# Altium schematic sheet Custom ST-Link V2.1.SchDoc: Custom ST-Link V2.1
size A3; PageSetup: Record=PageOptions|CenterHorizontal=True|CenterVertical=True|PrintScale=0.97|XCorrection=1.00|YCorrection=1.00|PrintKind=0|BorderSize=5000000|LeftOffset=0|BottomOffset=0|Orientation=2|PaperLength=1000|PaperWidth=1000|Scale=100|PaperSource=7|PrintQuality=-3|MediaType=1|DitherType=10|PrintScaleMode=1|PaperKind=A4|PaperIndex=9; Address2: Florian Baumgartner; DocumentNumber: Based on ST-Link V2.x design; Revision: V1.0; SheetNumber: 1; SheetTotal: 2; Author: Florian Baumgartner
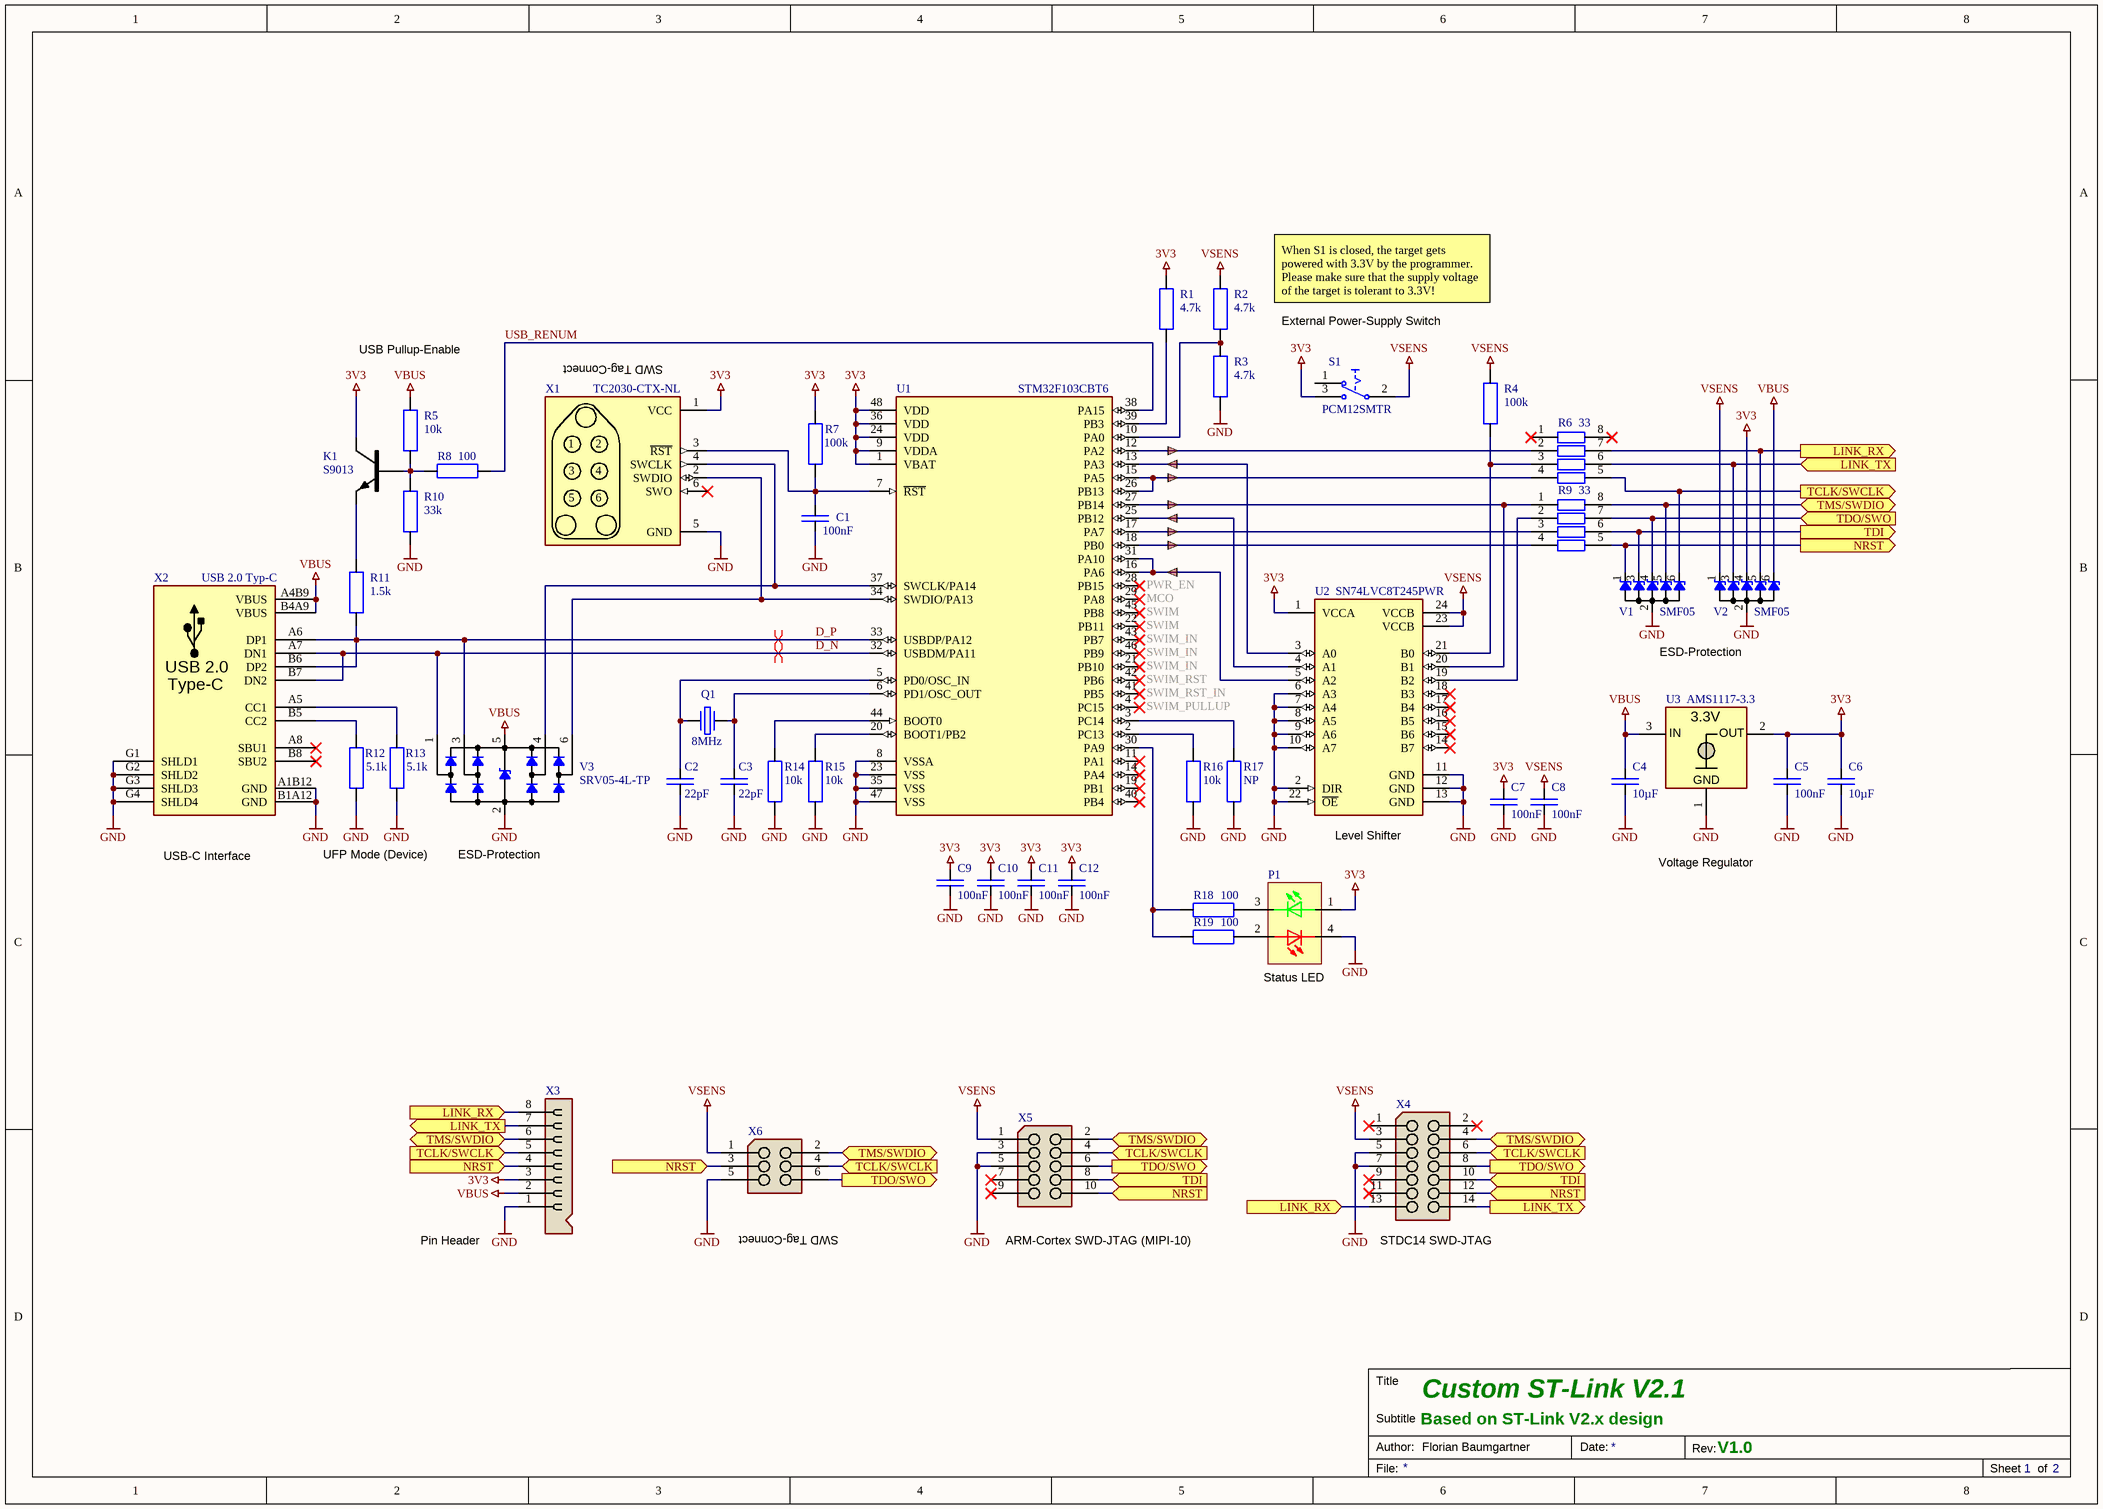
[diagram p0: Custom ST-Link V2.1.SchDoc]

## Parts
C1  100nF  [SMD Keramikkondensator 0402]
C2  22pF  [SMD Keramikkondensator 0402]
C3  22pF  [SMD Keramikkondensator 0402]
C4  10µF  [SMD Keramikkondensator 0603]
C5  100nF  [SMD Keramikkondensator 0402]
C6  10µF  [SMD Keramikkondensator 0603]
C7  100nF  [SMD Keramikkondensator 0402]
C8  100nF  [SMD Keramikkondensator 0402]
C9  100nF  [SMD Keramikkondensator 0402]
C10  100nF  [SMD Keramikkondensator 0402]
C11  100nF  [SMD Keramikkondensator 0402]
C12  100nF  [SMD Keramikkondensator 0402]
K1  S9013  [SMD Transistor SOT-23]
P1  LTST-C155KGJRKT  [SMD LED 1210]  (value not drawn)
Q1  8MHz  [SMD Crystal 5.0X3.2X1.8]
R1  4.7k  [SMD Widerstand 0402]
R2  4.7k  [SMD Widerstand 0402]
R3  4.7k  [SMD Widerstand 0402]
R4  100k  [SMD Widerstand 0402]
R5  10k  [SMD Widerstand 0402]
R6  33  [SMD Widerstand Array 4-Fach 0402]
R7  100k  [SMD Widerstand 0402]
R8  100  [SMD Widerstand 0402]
R9  33  [SMD Widerstand Array 4-Fach 0402]
R10  33k  [SMD Widerstand 0402]
R11  1.5k  [SMD Widerstand 0402]
R12  5.1k  [SMD Widerstand 0402]
R13  5.1k  [SMD Widerstand 0402]
R14  10k  [SMD Widerstand 0402]
R15  10k  [SMD Widerstand 0402]
R16  10k  [SMD Widerstand 0402]
R17  NP  [SMD Widerstand 0402]
R18  100  [SMD Widerstand 0402]
R19  100  [SMD Widerstand 0402]
S1  PCM12SMTR  [SMD Switch SPDT (PCM12SMTR)]
U1  STM32F103CBT6  [SMD IC LQFP-48]
U2  SN74LVC8T245PWR  [SMD IC TSSOP-24]
U3  AMS1117-3.3  [SMD IC SOT-223]
V1  SMF05  [SMD IC SOT-363 (SC-70-6)]
V2  SMF05  [SMD IC SOT-363 (SC-70-6)]
V3  SRV05-4L-TP  [SMD IC SOT-23-6]
X1  TC2030-CTX-NL  [SMD Connector TC2030-CTX-NL]  (no BOM)
X2  USB 2.0 Typ-C  [SMD USB-C Socket (A40-00119)]
X3  Buchsenleiste (8-Fach)  [SMD Buchsenleiste 8-Pol (1x8) 90°]  (value not drawn)
X4  JTAG-Header (STDC14)  [SMD Connector 1.27mm (2x7)]  (value not drawn)
X5  JTAG-Header (ARM-Cortex)  [SMD Connector 1.27mm (2x5)]  (value not drawn)
X6  JTAG-Header (Tag-Connect)  [SMD Flachbandkabel 6-Pol Vertikal]  (value not drawn)

## Ports
LINK_RX (in), LINK_RX (out), LINK_TX (in), LINK_TX (out), NRST (in), NRST (out), TCLK/SWCLK (in), TCLK/SWCLK (out), TDI (in), TDI (out), TDO/SWO (in), TDO/SWO (out), TMS/SWDIO (bidir)

## Nets
3V3: C5.2 C6.2 C7.2 C9.2 C10.2 C11.2 C12.2 K1.C P1.1(GA) R1.2 R7.2 S1.3(NO1) U1.1(VBAT) U1.9(VDDA) U1.24(VDD) U1.36(VDD) U1.48(VDD) U2.1(VCCA) U3.2(OUT) V2.4(K) X1.1(VCC) X3.3
GND: C1.1 C2.2 C3.2 C4.1 C5.1 C6.1 C7.1 C8.1 C9.1 C10.1 C11.1 C12.1 P1.4(RC) R3.1 R10.1 R12.1 R13.1 R14.1 R15.1 R16.1 R17.1 U1.8(VSSA) U1.23(VSS) U1.35(VSS) U1.47(VSS) U2.2(DIR) U2.6(A3) U2.7(A4) U2.8(A5) U2.9(A6) U2.10(A7) U2.11(GND) U2.12(GND) U2.13(GND) U2.22(~{OE}) U3.1(GND) V1.2(A) V2.2(A) V3.2(A) X1.5(GND) X2.A1B12(GND) X2.B1A12(GND) X2.G1(SHLD1) X2.G2(SHLD2) X2.G3(SHLD3) X2.G4(SHLD4) X3.1 X4.5 X4.7 X5.3 X5.5 X6.5
VBUS: C4.2 R5.2 U3.3(IN) V2.6(K) V3.5(K) X2.A4B9(VBUS) X2.B4A9(VBUS) X3.2
VSENS: C8.2 R2.2 R4.2 S1.2(COMMON1) U2.23(VCCB) U2.24(VCCB) V2.1(K) X4.3 X5.1 X6.1
D_N: U1.32(USBDM/PA11) V3.1(K) X2.A7(DN1) X2.B7(DN2)
D_P: R11.1 U1.33(USBDP/PA12) V3.3(K) X2.A6(DP1) X2.B6(DP2)
LINK_RX: R6.7 V2.5(K) X3.8 X4.13 ; port LINK_RX
LINK_TX: R6.6 V2.3(K) X3.7 X4.14 ; port LINK_TX
NRST: R9.5 V1.1(K) X3.4 X4.12 X5.10 X6.3 ; port NRST
TCLK/SWCLK: R6.5 V1.6(K) X3.5 X4.6 X5.4 X6.4 ; port TCLK/SWCLK
TDI: R9.6 V1.3(K) X4.10 X5.8 ; port TDI
TDO/SWO: R9.7 V1.4(K) X4.8 X5.6 X6.6 ; port TDO/SWO
TMS/SWDIO: R9.8 V1.5(K) X3.6 X4.4 X5.2 X6.2 ; port TMS/SWDIO
USB_RENUM: R8.2 U1.38(PA15)
NetC1_2: C1.2 R7.1 U1.7(~{RST}) X1.3(~{RST})
NetC2_1: C2.1 Q1.1 U1.5(PD0/OSC_IN)
NetC3_1: C3.1 Q1.2 U1.6(PD1/OSC_OUT)
NetK1_B: K1.B R5.1 R8.1 R10.2
NetK1_E: K1.E R11.2
NetP1_2: P1.2(RA) R19.2
NetP1_3: P1.3(GC) R18.2
NetR1_1: R1.1 U1.39(PB3)
NetR2_1: R2.1 R3.2 U1.10(PA0)
NetR4_1: R4.1 R6.3 U2.21(B0)
NetR6_2: R6.2 U1.12(PA2)
NetR6_4: R6.4 U1.15(PA5) U1.26(PB13)
NetR9_1: R9.1 U1.27(PB14) U2.20(B1)
NetR9_2: R9.2 U2.19(B2)
NetR9_3: R9.3 U1.17(PA7)
NetR9_4: R9.4 U1.18(PB0)
NetR12_2: R12.2 X2.B5(CC2)
NetR13_2: R13.2 X2.A5(CC1)
NetR14_2: R14.2 U1.44(BOOT0)
NetR15_2: R15.2 U1.20(BOOT1/PB2)
NetR16_2: R16.2 U1.2(PC13)
NetR17_2: R17.2 U1.3(PC14)
NetR18_1: R18.1 R19.1 U1.30(PA9)
NetU1_13: U1.13(PA3) U2.3(A0)
NetU1_16: U1.16(PA6) U1.31(PA10) U2.5(A2)
NetU1_25: U1.25(PB12) U2.4(A1)
NetU1_34: U1.34(SWDIO/PA13) V3.6(K) X1.2(SWDIO)
NetU1_37: U1.37(SWCLK/PA14) V3.4(K) X1.4(SWCLK)

Not connected (* = marked no-connect by the designer): R6 1* 8*; S1 1(NC1); U1 4(PC15)* 11(PA1)* 14(PA4)* 19(PB1)* 21(PB10)* 22(PB11)* 28(PB15)* 29(PA8)* 40(PB4)* 41(PB5)* 42(PB6)* 43(PB7)* 45(PB8)* 46(PB9)*; U2 14(B7)* 15(B6)* 16(B5)* 17(B4)* 18(B3)*; X1 6(SWO)*; X2 A8(SBU1)* B8(SBU2)*; X4 1* 2* 9* 11*; X5 7* 9*

## Layout directives
differential pair: D_N, D_P

## Notes on the sheet
- When S1 is closed, the target gets powered with 3.3V by the programmer.
  Please make sure that the supply voltage of the target is tolerant to 3.3V!
- USB Pullup-Enable
- (near X1) SWD Tag-Connect
- External Power-Supply Switch
- (near U1) PWR_EN
- (near U1) MCO
- (near U1) SWIM
- (near U1) SWIM_IN
- (near U1) SWIM_RST_IN
- (near U1) SWIM_RST
- SWIM_PULLUP
- ESD-Protection
- (near X2) USB-C Interface
- UFP Mode (Device)
- (near V3) ESD-Protection
- (near U2) Level Shifter
- Voltage Regulator
- Status LED
- Pin Header
- SWD Tag-Connect
- (near X5) ARM-Cortex SWD-JTAG (MIPI-10)
- (near X4) STDC14 SWD-JTAG
- Title
- Author:
- Subtitle
- Date:
- Rev:
- File:
- Sheet
- of
- (in symbol T-AMS1117-3.3) 3.3V
- (in symbol X-USB-Buchse) USB 2.0; Type-C

## Library data of the parts
C1 C5 C7-C12 = C-CAPACITOR: CAP-MK; Beschreibung: Keramikvielschichtkondensator; Bauteilwert: 100nF 50V; Stückpreis: 0.01; Digikey: 445-6899-1-ND; Farnell: 2210822; Mouser: 810-CGA2B3X7R1H104K; JLC-Parts: C1525
C2 C3 = C-CAPACITOR: CAP-MK; Beschreibung: Keramikvielschichtkondensator; Stückpreis: 0.01; Bauteilwert: 22pF; Digikey: 311-1018-1-ND; Farnell: 3019184; Mouser: 603-CC402JRNPO9BN220; JLC-Parts: C1555
C4 C6 = C-CAPACITOR: CAP-MK; Beschreibung: Keramikvielschichtkondensator; Bauteilwert: 10µF 10V; Stückpreis: 0.17; Digikey: 587-3258-1-ND; Farnell: 2113070; Mouser: 963-LMK107BBJ106MALT; JLC-Parts: C19702
K1 = K-BIPT:NPN: Transistor NPN (alt V und T); Beschreibung: General Purpose Transistor NPN; aliExpress: 4001032177922; Stückpreis: 0.01; Bauteilwert: S9013; ComponentLink1Description: Datasheet; ComponentLink1URL: https://datasheet.lcsc.com/szlcsc/Changjiang-Electronics-Tech-CJ-S9013_C6749.pdf; JLC-Parts: C6749
P1 = P-LTST-C155KGJRKT: LED Red/Green; Stückpreis: 0.35; Bauteilwert: LTST-C155KGJRKT; Beschreibung: LED Red/Green; Digikey: 160-1409-1-ND; Farnell: 2062277; Mouser: 859-LTST-C155KGJRKT; ComponentLink1Description: Datasheet; ComponentLink1URL: https://datasheet.lcsc.com/szlcsc/Lite-On-LTST-C155KGJRKT_C115448.pdf; JLC-Parts: C115448
Q1 = B-QUARZ: Crystal with Shielding; Bauteilwert: X50328MSB2GI (8MHz); aliExpress: 32890177031; Stückpreis: 0.17; Beschreibung: Crystal with Shielding; JLC-Parts: C115962; ComponentLink1Description: Datasheet; ComponentLink1URL: https://datasheet.lcsc.com/szlcsc/1903061615_Yangxing-Tech-X50328MSB2GI_C115962.pdf
R1-R3 = R-RESISTOR: SMD-Widerstand 1/4W; Beschreibung: Dickschicht Chipwiderstand; Bauteilwert: 4.7k (75V, 100mW, 1%); Stückpreis: 0.01; Digikey: P4.70KLCT-ND; Farnell: 2302707; Mouser: 667-ERJ-2RKF4701X; JLC-Parts: C25900
R4 R7 = R-RESISTOR: RES (E=Heizwiderstand B=Messwandler); Beschreibung: Dickschicht Chipwiderstand; Bauteilwert: 100k (75V, 100mW, 1%); Stückpreis: 0.01; Digikey: P100KLCT-ND; Farnell: 2302839; Mouser: 667-ERJ-2RKF1003X; JLC-Parts: C25741
R5 R14-R16 = R-RESISTOR: RES (E=Heizwiderstand B=Messwandler); Beschreibung: Dickschicht Chipwiderstand; Bauteilwert: 10k (75V, 100mW, 1%); Stückpreis: 0.01; Digikey: P10.0KLCT-ND; Farnell: 2302739; Mouser: 667-ERJ-2RKF1002X; JLC-Parts: C25744
R6 R9 = R-Array Single (4-Fach): Isolated Resistor Array; Bauteilwert: 33 (4x, 50V, 62.5mW, 5%); Stückpreis: 0.01; Beschreibung: Isolated Resistor Array; Digikey: Y7330CT-ND; Farnell: 2060035; JLC-Parts: C25501; Mouser: 667-EXB-28V330JX
R8 R18 R19 = R-RESISTOR: SMD-Widerstand 1/4W; Beschreibung: Dickschicht Chipwiderstand; Bauteilwert: 100 (75V, 100mW, 1%); Stückpreis: 0.06; Digikey: P100LCT-ND; Farnell: 2302528; Mouser: 667-ERJ-2RKF1000X; JLC-Parts: C25076
R10 = R-RESISTOR: RES (E=Heizwiderstand B=Messwandler); Beschreibung: Dickschicht Chipwiderstand; Bauteilwert: 33k (75V, 100mW, 1%); Stückpreis: 0.01; Digikey: P33.0KLCT-ND; Farnell: 2561707; Mouser: 667-ERJ-2RKF3302X; JLC-Parts: C25779
R11 = R-RESISTOR: RES (E=Heizwiderstand B=Messwandler); Beschreibung: Dickschicht Chipwiderstand; Bauteilwert: 1.5k (75V, 100mW, 1%); Stückpreis: 0.01; Digikey: P1.50KLCT-ND; Farnell: 2302656; Mouser: 667-ERJ-2RKF1501X; JLC-Parts: C25867
R12 R13 = R-RESISTOR: SMD-Widerstand 1/4W; Beschreibung: Dickschicht Chipwiderstand; Bauteilwert: 5.1k (75V, 100mW, 1%); Stückpreis: 0.01; Digikey: P5.10KLCT-ND; Farnell: 2302709; Mouser: 667-ERJ-2RKF5101X; JLC-Parts: C25905
R17 = R-RESISTOR: RES (E=Heizwiderstand B=Messwandler); Beschreibung: Dickschicht Chipwiderstand; Bauteilwert: NP
S1 = S-PCM12SMTR: Miniature Slide Switch; Stückpreis: 0.77; Bauteilwert: PCM12SMTR (SPDT); aliExpress: 33002042977; Digikey: 401-2016-1-ND; Beschreibung: Miniature Slide Switch; Mouser: 611-PCM12SMTR; Farnell: 9575146
U1 = U-STM32F103CBT6: ARM Cortex-M3 MCU (72MHz, 128kB, 20kB); aliExpress: 4001126101952; Stückpreis: 3.87; Bauteilwert: STM32F103CBT6; Beschreibung: ARM Cortex-M3 MCU (72MHz, 128kB, 20kB); Digikey: 497-6288-ND; Farnell: 1606327; Mouser: 511-STM32F103CBT6; JLC-Parts: C8304
U2 = U-SN74LVC8T245PWR: Octal dual supply translating transceiver; Beschreibung: 8-Bit Dual-Supply Bus Transceiver; aliExpress: 32958343098; Stückpreis: 0.52; Bauteilwert: SN74LVC8T245PWR; Digikey: 296-18593-1-ND; Farnell: 2459199; Mouser: 595-SN74LVC8T245PWR; ComponentLink1Description: Datasheet; ComponentLink1URL: https://www.ti.com/lit/ds/symlink/sn74lvc8t245.pdf?HQS=TI-null-null-digikeymode-df-pf-null-wwe&ts=1607029625665; JLC-Parts: C27643
U3 = T-AMS1117-3.3: LDO Voltage Regulator; Beschreibung: Spannungsregler LDO; Bauteilwert: AMS1117-3.3 (3.3V, 1A); Stückpreis: 0.12; Digikey: LM1117IMP-3.3/NOPBCT-ND; Farnell: 3116241; Mouser: 926-LM1117IMP3.3NOPB; JLC-Parts: C6186
V1 V2 = V-SMF05CT1G: Suppressor Diode Array; Stückpreis: 0.11; AliExpress: 32921815664; Farnell: 2533147; Digikey: SMF05CT1GOSCT-ND; Mouser: 863-SMF05CT1G; Beschreibung: Suppressor Diode Array; Bauteilwert: SMF05CT1G; JLC-Parts: C15879
V3 = V-SRV05-4L-TP: Ultra Low Capacitance TVS Array; Stückpreis: 0.16; AliExpress: 32921815664; Farnell: 1924492; Digikey: SRV05-4L-TPMSCT-ND; Mouser: 833-SRV05-4L-TP863-SMF05CT1G; Beschreibung: Ultra Low Capacitance TVS Array; Bauteilwert: SRV05-4L-TP; JLC-Parts: C85364
X1 = X-TC2030-CTX-NL: Tag-Connect for ARM-Cortex (6-Pin); Stückpreis: 0.00; Bauteilwert: TC2030-CTX-NL; Beschreibung: Tag-Connect for ARM-Cortex (6-Pin)
X2 = X-USB-Buchse: Typ-C; Bauteilwert: USB 2.0 Typ-C (USB4105-GF-A); Beschreibung: USB Buchse; aliExpress: 33045191307; Stückpreis: 1.72; Digikey: 2073-USB4105-GF-ACT-ND; Farnell: 3583366
X3 = X-Buchsenleiste (8-Fach): Beschreibung: Pin Header Right Angle Female; Bauteilwert: M20-7910842R (8-Pin); aliExpress: 33004022240; Stückpreis: 0.94; Digikey: 952-3200-1-ND; Farnell: 3226218; Mouser: 855-M20-7910842R
X4 = X-JTAG-Header (STDC14): Bauteilwert: SHF-107-01-L-D-SM (2x7); Stückpreis: 0.87; Beschreibung: JTAG-Header (STDC14); Digikey: 1175-1632-ND; Mouser: 200-SHF10701LDSM
X5 = X-JTAG-Header (ARM-Cortex): Bauteilwert: SHF-105-01-L-D-SM (2x5); Stückpreis: 2.89; Beschreibung: JTAG-Header (ARM-Cortex); Digikey: SAM10710-ND; Farnell: 1885915; Mouser: 200-SHF10501LDSM
X6 = X-JTAG-Header (Tag-Connect): Bauteilwert: N2506-6V0C-RB-WD (6-Pol); aliExpress: 32769730667; Stückpreis: 0.47; Beschreibung: JTAG-Header (Tag-Connect); Digikey: 1175-1864-ND; Mouser: 517-N2506-6V0C-RB-WD